# EasyEDA Pro project ProPrj_esp8266(esp12S)_2024-11-05.epro

# Schematic Schematic1_1
Create Date: 2024-01-08; Page Name: P1; Project Name: esp8266(esp12S); Schematic Name: Schematic1_1; Update Date: 2024-03-04; Company: YUAXI; Drawed: YUAXI; Page Size: A4; Reviewed: YUAXI; Version: V1.0
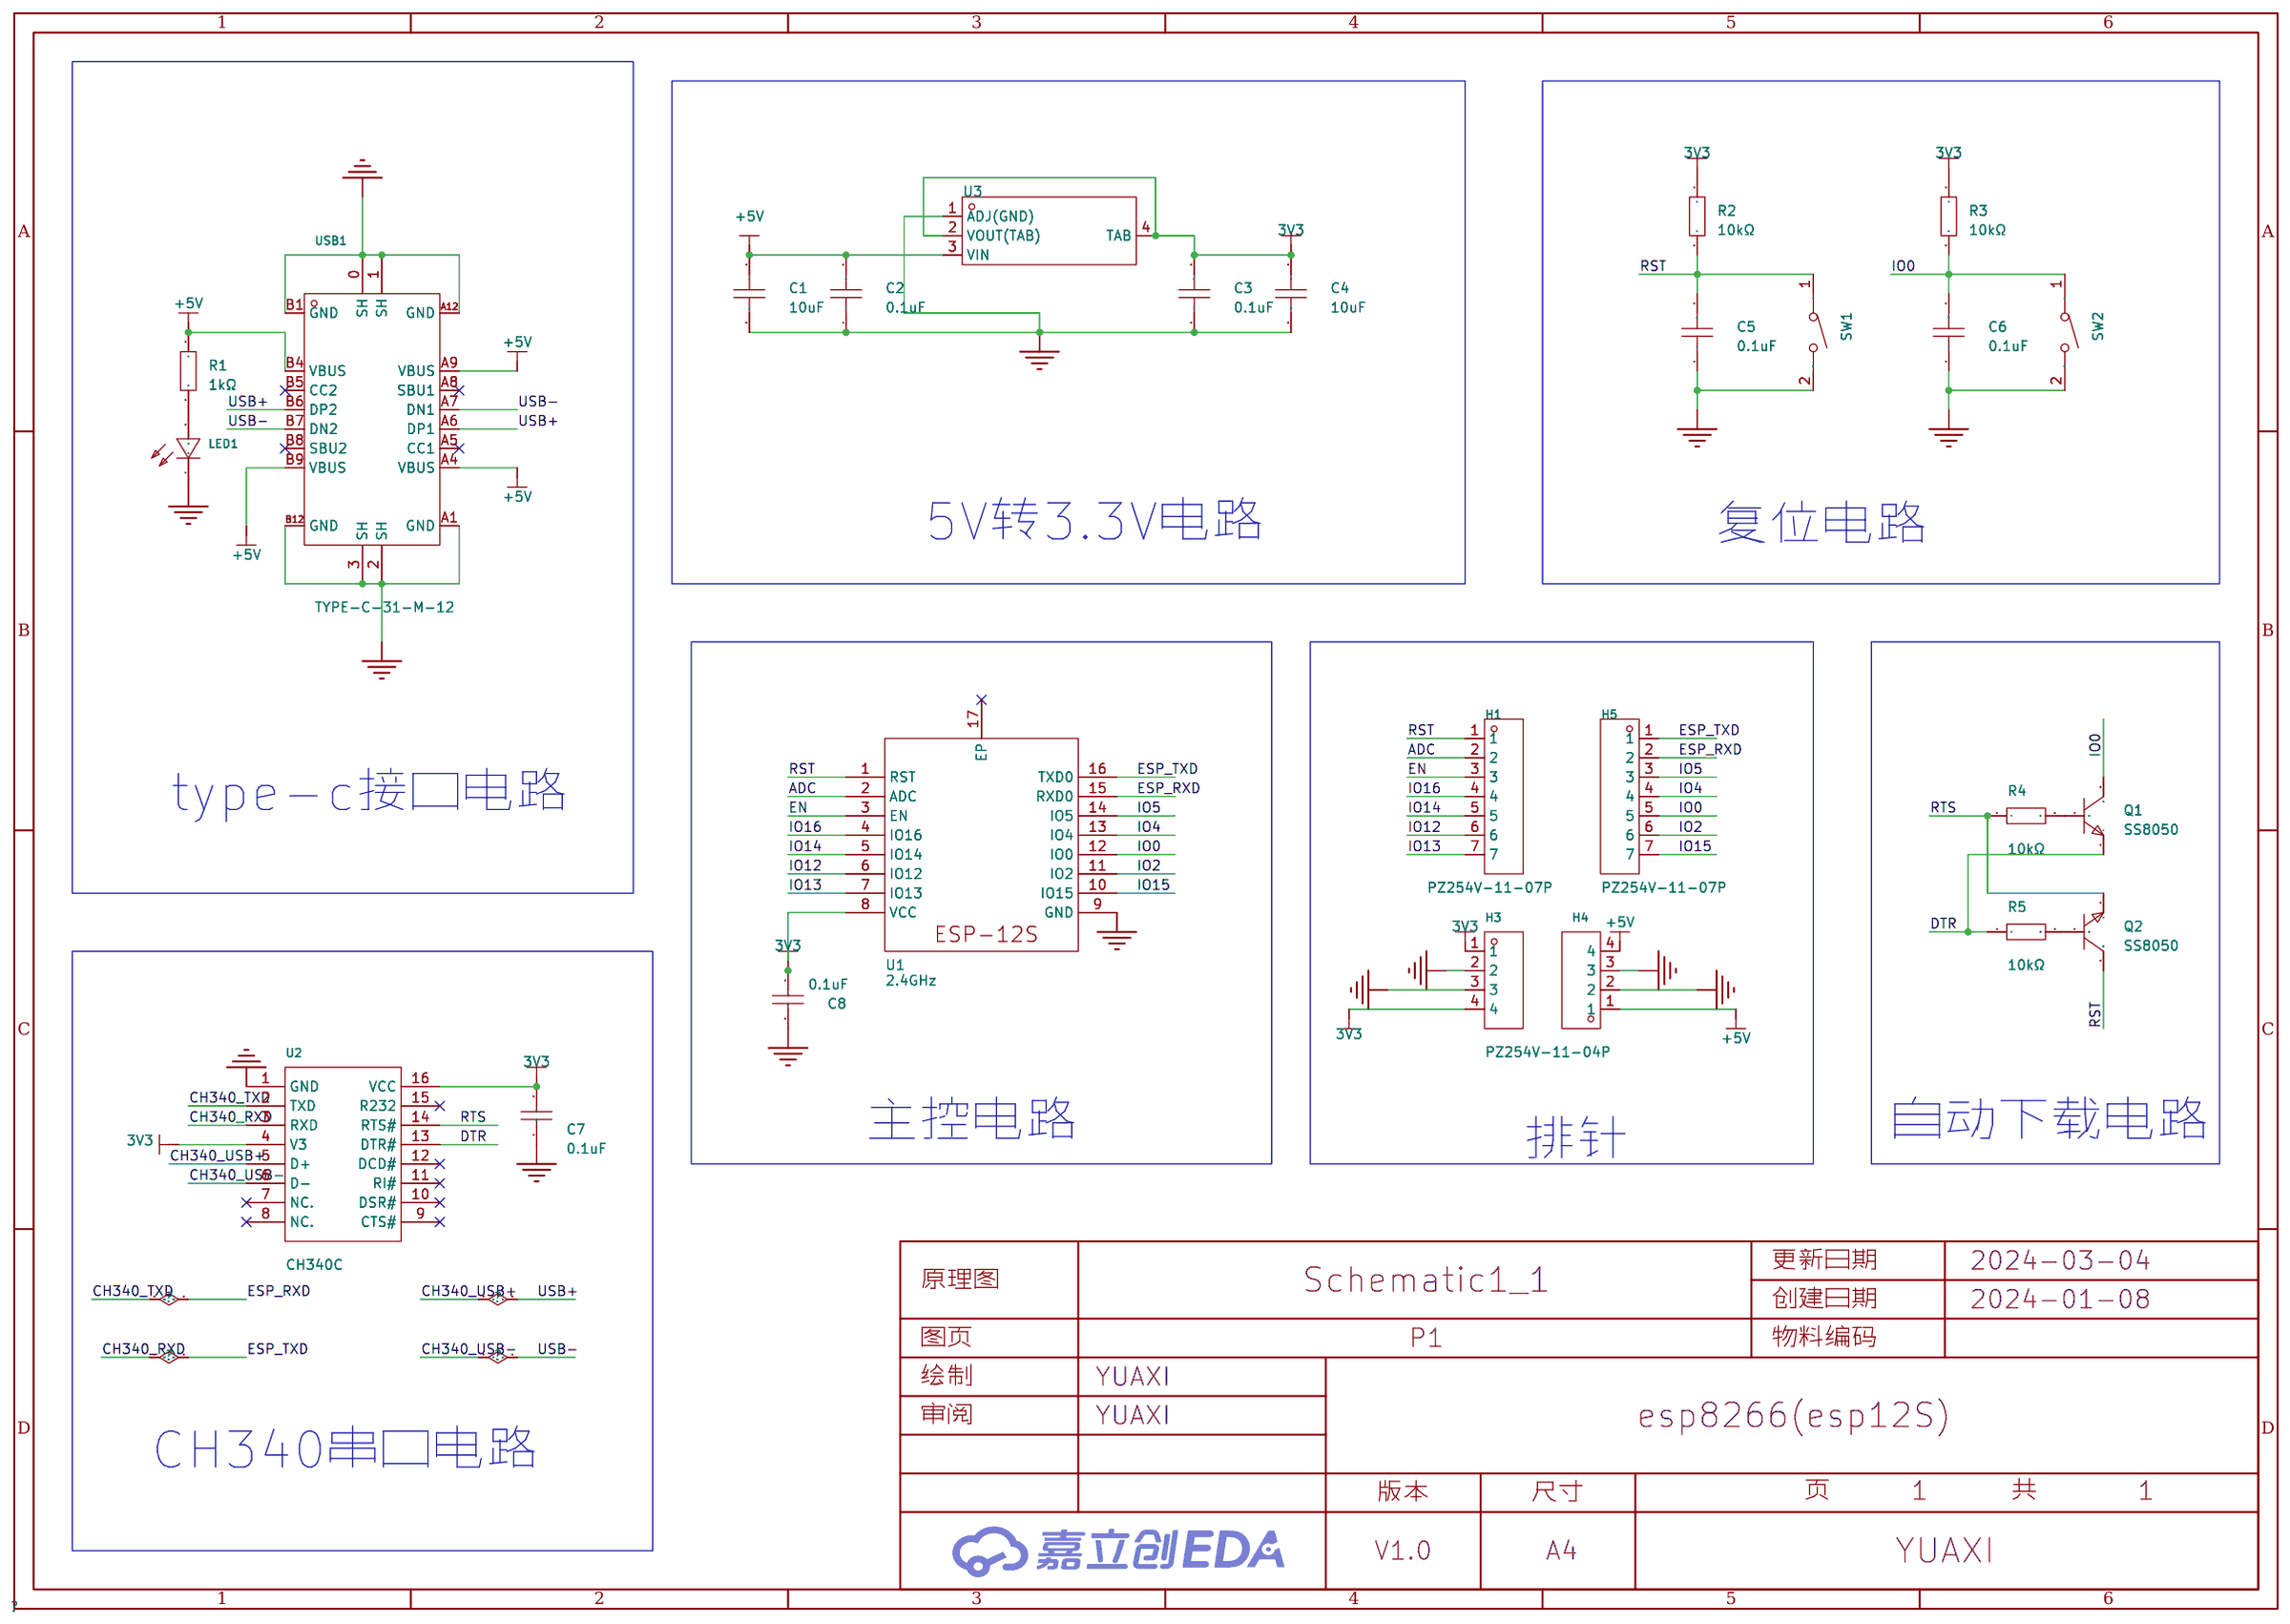
[diagram p0: schematic sheet]

## Parts
C1  10uF  [C0603]
C2  0.1uF  [C0603]
C3  0.1uF  [C0603]
C4  10uF  [C0603]
C5  0.1uF  [C0603]
C6  0.1uF  [C0603]
C7  0.1uF  [C0603]
C8  0.1uF  [C0603]
H1  PZ254V-11-07P  [HDR-TH_7P-P2.54-V-M]
H3  PZ254V-11-04P  [HDR-TH_4P-P2.54-V-M]
H4  PZ254V-11-04P  [HDR-TH_4P-P2.54-V-M]
H5  PZ254V-11-07P  [HDR-TH_7P-P2.54-V-M]
LED1  NCD0603R1  [LED0603-RD_RED]
Q1  SS8050  [SOT-23-3_L2.9-W1.3-P1.90-LS2.4-BR]
Q2  SS8050  [SOT-23-3_L2.9-W1.3-P1.90-LS2.4-BR]
R1  1kΩ  [R0603]
R2  10kΩ  [R0603]
R3  10kΩ  [R0603]
R4  10kΩ  [R0603]
R5  10kΩ  [R0603]
SW1  TS-1088-AR02016  [SW-SMD_L3.9-W3.0-P4.45]
SW2  TS-1088-AR02016  [SW-SMD_L3.9-W3.0-P4.45]
U1  2.4GHz  [WIRELM-SMD_ESP-12S]
U2  CH340C  [SOP-16_L10.0-W3.9-P1.27-LS6.0-BL]
U3  AMS1117-3.3  [SOT-223-4_L6.5-W3.5-P2.30-LS7.0-BR]
USB1  TYPE-C-31-M-12  [USB-C_SMD-TYPE-C-31-M-12]

## Library data of the parts
C1 C3 C5 C6 = CC0603KRX7R9BB104: 容值:100nF;精度:±10%;额定电压:50V;材质(温度系数):X7R;; LCSC Part Name: 100nF ±10% 50V; Supplier Part: C14663; Manufacturer: YAGEO(国巨); Supplier Footprint: 0603; JLCPCB Part Class: 基础库; Datasheet: https://atta.szlcsc.com/upload/public/pdf/source/20180910/C282072_33301C7F631E79921B82A8DAC6BCC5B3.pdf; Supplier: LCSC; Tolerance: ±10%; Voltage Rated: 50V; Temperature Coefficient: X7R
C2 C4 = CL10A106KP8NNNC: 容值:10uF;精度:±10%;额定电压:10V;材质(温度系数):X5R;; LCSC Part Name: 10uF ±10% 10V; Supplier Part: C19702; Manufacturer: SAMSUNG(三星); Supplier Footprint: 0603; JLCPCB Part Class: 基础库; Datasheet: https://atta.szlcsc.com/upload/public/pdf/source/20160103/1457707703378.pdf; Supplier: LCSC; Tolerance: ±10%; Voltage Rated: 10V; Temperature Coefficient: X5R
C7 C8 = 0603F104M500NT: 容值:100nF;精度:±20%;额定电压:50V;材质(温度系数):Y5V;; LCSC Part Name: 100nF ±20% 50V; Supplier Part: C42998; Manufacturer: FH(风华); Supplier Footprint: 0603; JLCPCB Part Class: 扩展库; Datasheet: https://atta.szlcsc.com/upload/public/pdf/source/20170923/C42998_1506149457343988769.pdf; Supplier: LCSC; Tolerance: ±20%; Voltage Rated: 50V; Temperature Coefficient: Y5V
H1 H5 = PZ254V-11-07P: 排数:单排;总PIN位数:7P;间距:2.54mm;插针结构:1x7P;行距:-;安装类型:直插;圆针/方针:方针;额定电流:-;额定电压:-;配合针长度:6mm;塑高:2.5mm;端接针长度:3mm;触头材质:黄铜;触头镀层:-;工作温度范围:-40℃~+105℃;颜色:黑色;; LCSC Part Name: 2.54mm 1x7P 直插 方针; Supplier Part: C492406; Manufacturer: XFCN(兴飞); Supplier Footprint: 插件,P=2.54mm; JLCPCB Part Class: 扩展库; Datasheet: https://atta.szlcsc.com/upload/public/pdf/source/20200309/C492406_654C533EE691117E22DD9F76C114C2D9.pdf; Supplier: LCSC; Number of Rows: 单排; Number of Pins: 7P; Pitch: 2.54mm; Pin Structure: 1x7P; Mounting Type: 直插; Circluar Pins/Square Pins: 方针; Length of Mating Pin: 6mm; Insulation Height: 2.5mm; Length of End Connection Pin: 3mm; Contact Material: 黄铜; Operating Temperature Range: -40℃~+105℃; Color: 黑色
H3 H4 = PZ254V-11-04P: 排数:单排;总PIN位数:4P;间距:2.54mm;插针结构:1x4P;行距:-;安装类型:直插;圆针/方针:方针;额定电流:3A;额定电压:250V;配合针长度:6mm;塑高:2.5mm;端接针长度:3mm;触头材质:-;工作温度范围:-40℃~+105℃;颜色:黑色;; LCSC Part Name: 2.54mm 1x4P 直插 方针; Supplier Part: C2691448; Manufacturer: XFCN(兴飞); Supplier Footprint: 插件,P=2.54mm; JLCPCB Part Class: Extended Part; Datasheet: https://atta.szlcsc.com/upload/public/pdf/source/20200309/C492403_F9F19131791D08044AD4F84F8E751A34.pdf; Supplier: LCSC; Number of Rows: 单排; Number of Pins: 4P; Pitch: 2.54mm; Pin Structure: 1x4P; Mounting Type: 直插; Circluar Pins/Square Pins: 方针; Current Rating (Max): 3A; Voltage Rating (Max): 250V; Length of Mating Pin: 6mm; Insulation Height: 2.5mm; Length of End Connection Pin: 3mm; Operating Temperature Range: -40℃~+105℃; Color: 黑色
LED1 = NCD0603R1_C84263: 发光颜色:红灯;; LCSC Part Name: 红灯 0603红灯   正贴; Supplier Part: C84263; Manufacturer: 国星光电; Supplier Footprint: 0603; JLCPCB Part Class: 扩展库; Datasheet: https://atta.szlcsc.com/upload/public/pdf/source/20200820/C84263_DABC6A75E58F576973B407FDBA283D60.pdf; Supplier: LCSC; Emitted Color: 红灯
Q1 Q2 = SS8050_C2150: 晶体管类型:NPN;集射极击穿电压(Vceo):25V;集电极电流(Ic):1.5A;功率(Pd):300mW;直流电流增益(hFE@Ic,Vce):200@100mA,1V;; LCSC Part Name: NPN 25V 1.5A Y1 200-350; Supplier Part: C2150; Manufacturer: CJ(江苏长电/长晶); Supplier Footprint: SOT-23; JLCPCB Part Class: 基础库; Datasheet: https://atta.szlcsc.com/upload/public/pdf/source/20230322/AEE86F4B043774EFF80CAEA14A37D9E9.pdf; Supplier: LCSC; Transistor Type: NPN; Collector-Emitter Breakdown Voltage (Vceo): 25V; Collector Current (Ic): 1.5A; Power Dissipation (Pd): 300mW; Collector Cut-Off Current (Icbo): 100nA; Collector-Emitter Saturation Voltage (VCE(sat)@Ic,Ib): 500mV@800mA,80mA; DC Current Gain (hFE@Ic,Vce): 200@100mA,1V; Transition Frequency (fT): 100MHz; Operating Temperature: +150℃@(Tj)
R1 = 0603WAF1001T5E: 电阻类型:厚膜电阻;阻值:1kΩ;精度:±1%;功率:100mW;温度系数:±100ppm/℃;; LCSC Part Name: 厚膜电阻 1kΩ ±1% 100mW; Supplier Part: C21190; Manufacturer: UNI-ROYAL(厚声); Supplier Footprint: 0603; JLCPCB Part Class: 基础库; Datasheet: https://atta.szlcsc.com/upload/public/pdf/source/20200306/C422600_1E6D84923E4A46A82E41ADD87F860B5C.pdf; Supplier: LCSC; Type: 厚膜电阻; Tolerance: ±1%; Power(Watts): 100mW; Temperature Coefficient: ±100ppm/℃; Overload Voltage (Max): 75V; Operating Temperature Range: -55℃~+155℃
R2-R5 = 0603WAF1002T5E: 电阻类型:厚膜电阻;阻值:10kΩ;精度:±1%;功率:100mW;; LCSC Part Name: 厚膜电阻 10kΩ ±1% 100mW; Supplier Part: C25804; Manufacturer: UNI-ROYAL(厚声); Supplier Footprint: 0603; JLCPCB Part Class: 基础库; Datasheet: https://atta.szlcsc.com/upload/public/pdf/source/20200306/C422600_1E6D84923E4A46A82E41ADD87F860B5C.pdf; Supplier: LCSC; Type: 厚膜电阻; Tolerance: ±1%; Power(Watts): 100mW; Temperature Coefficient: ±100ppm/℃; Overload Voltage (Max): 75V; Operating Temperature Range: -55℃~+155℃
SW1 SW2 = TS-1088-AR02016: 电路结构:单刀单掷;带支架:否;触点电流:50mA;额定电压(DC):12V;安装方式:立贴;绝缘电阻:100MΩ;作用力:160gf@±50gf;机械寿命:10万次;; LCSC Part Name: 4*3*2mm 立贴 轻触开关; Supplier Part: C720477; Manufacturer: XUNPU(讯普); Supplier Footprint: SMD; JLCPCB Part Class: 扩展库; Datasheet: https://atta.szlcsc.com/upload/public/pdf/source/20200810/C720475_60D09DD6C54279ADDB2DC25100F1CC11.pdf; Supplier: LCSC; Circuit: 单刀单掷; Actuator Style: 圆形按钮; Switch Length: 4mm; Switch Width: 3mm; Switch Height: 2mm; Strike Gundam: 否; Contact Current: 50mA; Voltage Rating (DC): 12V; Mounting Style: 立贴; Insulation Resistance: 100MΩ; Actuator/Cap Color: 黑色; Operating Force: 160gf@±50gf; Pin Style: SMD接片; Mechanical Life: 10万次; Operating Temperature: -30℃~+80℃
U1 = ESP-12S: 频率:2.4GHz;发射功率:16dBm;核心处理器:ESP32;天线形式:PCB 板载天线;接收灵敏度:-90dBm;; Supplier Part: C82898; Manufacturer: Ai-Thinker(安信可); Supplier Footprint: SMD,16x24mm; JLCPCB Part Class: 扩展库; Datasheet: https://atta.szlcsc.com/upload/public/pdf/source/20180726/C82898_9FA1708C134FC93491C81360A8B073B0.pdf; Supplier: LCSC; Output Power: 16dBm; Core Processor: ESP32; Support Interface: GPIO；UART；PWM；ADC; Antenna Type: PCB 板载天线; Wireless Standard: 802.11b/g/n; Operating Voltage: 3.3V; Receive  Current: 56mA; Send  Current: 170mA; Sensitivity: -90dBm; Operating Temperature: -20℃~+85℃
U2 = CH340C: 应用功能:收发器;接口协议:USB 2.0;数据速率:2Mbps;; LCSC Part Name: CH340C USB转串口芯片 CH340; Supplier Part: C84681; Manufacturer: WCH(南京沁恒); Supplier Footprint: SOP-16; JLCPCB Part Class: 扩展库; Datasheet: https://atta.szlcsc.com/upload/public/pdf/source/20200819/C84681_ADBED554CE321879DBD6B1D06488689C.pdf; Supplier: LCSC; Applications Function: 收发器; Protocol: USB 2.0; Data Rate: 2Mbps; Supply Voltage: 3.3V；5V
U3 = AMS1117-3.3_C347222: 输出类型:固定;最大输入电压:18V;输出电压:3.3V;输出电流:1A;电源纹波抑制比(PSRR):60dB@(120Hz);输出极性:正;; LCSC Part Name: 输入18V 输出3.3V 1A; Supplier Part: C347222; Manufacturer: UMW(友台半导体); Supplier Footprint: SOT-223; JLCPCB Part Class: Extended Part; Datasheet: https://atta.szlcsc.com/upload/public/pdf/source/20231109/155D79A26D9DB04352555A58D5969DC8.pdf; Supplier: LCSC; Output Type: 固定; Output Polarity: 正; Number of Outputs: 1; Maximum Input Voltage: 18V; Output Voltage: 3.3V; Dropout Voltage: 1.3V@(1A); Output Current: 1A; Power Supply Rejection Ratio (PSRR): 60dB@(120Hz)
USB1 = TYPE-C-31-M-12: 连接器类型:Type-C;标准:-;公母:母座;触点数量:16P;端口数量:1;安装方式:-;额定电流 - 电源:5A;触头材质:-;触头镀层:-;工作温度范围:-;焊接温度(最大值):-;; LCSC Part Name: Type-C 母座; Supplier Part: C165948; Manufacturer: 韩国韩荣; Supplier Footprint: SMD; JLCPCB Part Class: Extended Part; Datasheet: https://atta.szlcsc.com/upload/public/pdf/source/20220525/466408E853115E789EDB0DDC29077C05.pdf; Supplier: LCSC; Connector Type: Type-C; Gender: 母座; Number of Contacts: 16P; Number of Ports: 1; Current Rating - Power (Max): 5A

## Nets
3V3: C3.2 C4.2 C7.2 C8.1 H3.1 H3.4 R2.1 R3.1 U1.8(VCC) U2.4(V3) U2.16(VCC) U3.2(VOUT(TAB)) U3.4(TAB)
+5V: C1.2 C2.2 H4.1 H4.4 R1.2 U3.3(VIN) USB1.A4(VBUS) USB1.A9(VBUS) USB1.B4(VBUS) USB1.B9(VBUS)
GND: C1.1 C2.1 C3.1 C4.1 C5.1 C6.1 C7.1 C8.2 H3.2 H3.3 H4.2 H4.3 LED1.1(K) SW1.2 SW2.2 U1.9(GND) U2.1(GND) U3.1(ADJ(GND)) USB1.0(SH) USB1.1(SH) USB1.2(SH) USB1.3(SH) USB1.A1(GND) USB1.A12(GND) USB1.B1(GND) USB1.B12(GND)
ADC: H1.2 U1.2(ADC)
CH340_RXD: H5.1 U1.16(TXD0) U2.3(RXD)
CH340_TXD: H5.2 U1.15(RXD0) U2.2(TXD)
CH340_USB+: U2.5(D+) USB1.A6(DP1) USB1.B6(DP2)
CH340_USB-: U2.6(D-) USB1.A7(DN1) USB1.B7(DN2)
DTR: Q1.2(E) R5.1 U2.13(DTR#)
EN: H1.3 U1.3(EN)
IO0: C6.2 H5.5 Q1.3(C) R3.2 SW2.1 U1.12(IO0)
IO2: H5.6 U1.11(IO2)
IO4: H5.4 U1.13(IO4)
IO5: H5.3 U1.14(IO5)
IO12: H1.6 U1.6(IO12)
IO13: H1.7 U1.7(IO13)
IO14: H1.5 U1.5(IO14)
IO15: H5.7 U1.10(IO15)
IO16: H1.4 U1.4(IO16)
RST: C5.2 H1.1 Q2.3(C) R2.2 SW1.1 U1.1(RST)
RTS: Q2.2(E) R4.1 U2.14(RTS#)
$1N1116: LED1.2(A) R1.1
$1N4878: Q1.1(B) R4.2
$1N4917: Q2.1(B) R5.2

Not connected (* = marked no-connect by the designer): U1 17(EP)*; U2 7(NC.)* 8(NC.)* 9(CTS#)* 10(DSR#)* 11(RI#)* 12(DCD#)* 15(R232)*; USB1 A5(CC1)* A8(SBU1)* B5(CC2)* B8(SBU2)*

## Notes on the sheet
- 复位电路
- 5V转3.3V电路
- type-c接口电路
- 主控电路
- 排针
- 自动下载电路
- CH340串口电路

# Board PCB1_1
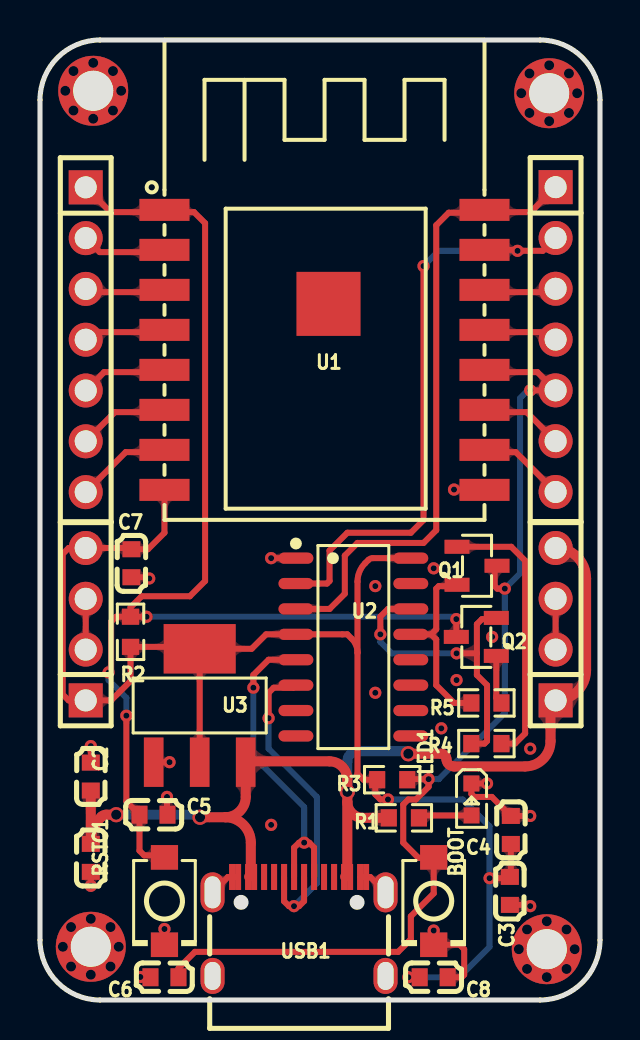
[diagram p1: board, top side]
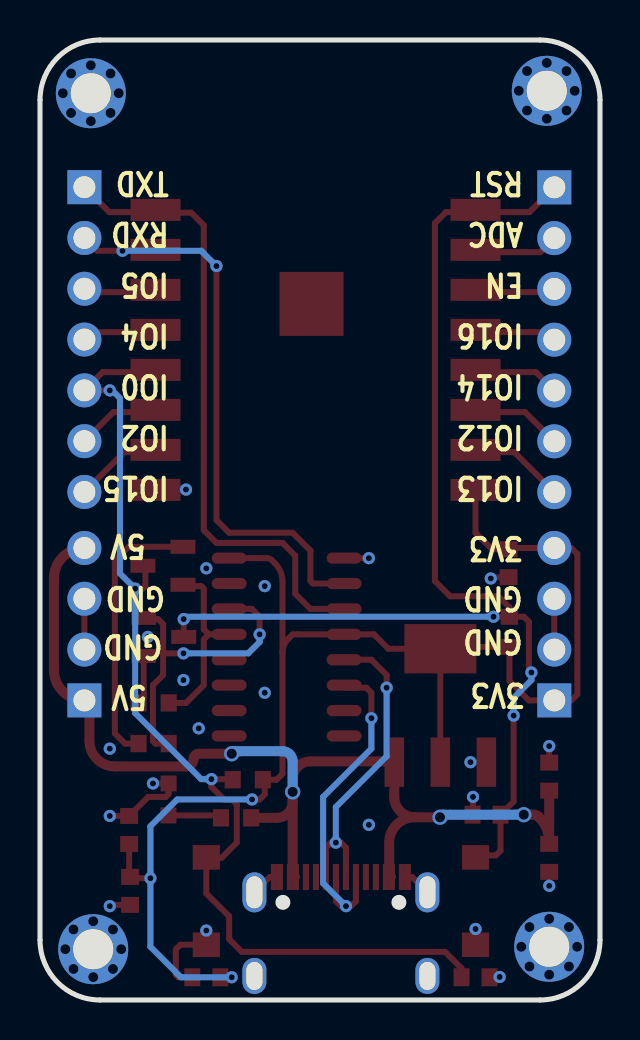
[diagram p2: board, bottom side, seen from below]

Outline 28 x 48 mm; copper layers: Top Layer, Bottom Layer. Coordinates in mm from the lower left corner of the outline.
Outline path: 0,45 0,3 arc(0.88,0.88) 3,0 25,0 arc(27.12,0.88) 28,3 28,45 arc(27.12,47.12) 25,48 3,48 arc(0.88,47.12) 0,45
Stack: Top Layer 0.035mm / Dielectric1 1.51mm FR4 er 4.5 / Bottom Layer 0.035mm

## Design rules (mm)
template: JLCPCB Capability(Two Layers Board)
spacing copperThickness1oz (default): track to track 0.102, other pairs 0.152 to 0.3
spacing copperThickness2oz: track to track 0.203, other pairs 0.152 to 0.3
track width copperThickness1oz (default): min 0.127, default 0.254, max 2.54
track width copperThickness2oz: min 0.203, default 0.254, max 2.54
differential pair differentialPair (default): width min 0.127, default 0.254, max 2.54; gap min 0.152, default 0.152
via viaSize (default): diameter min 0.5, default 0.61, max 10; hole min 0.3, default 0.305, max 6.3

## Placement (name value [footprint] x y rotation side)
BOOT  TS-1088-AR02016  [SW-SMD_L3.9-W3.0-P4.45]  19.69 4.95 270 top
C1  10uF  [C0603]  2.54 7.11 90 top
C2  0.1uF  [C0603]  2.54 11.17 270 top
C3  0.1uF  [C0603]  23.5 5.46 90 top
C4  10uF  [C0603]  23.54 8.5 270 top
C5  0.1uF  [C0603]  5.68 9.27 180 top
C6  0.1uF  [C0603]  6.22 1.14 0 top
C7  0.1uF  [C0603]  4.57 21.84 90 top
C8  0.1uF  [C0603]  19.69 1.14 0 top
LED1  NCD0603R1  [LED0603-RD_RED]  21.57 10.03 270 top
NOREF  -  [Pad_e13549]  2.54 2.66 0 top
NOREF#2  -  [Pad_e13617]  25.34 2.54 90 top
NOREF#3  -  [Pad_e13676]  25.46 45.34 180 top
NOREF#4  -  [HDR-TH_4P-P2.54-V-M]  2.29 18.79 90 top
NOREF#5  -  [HDR-TH_4P-P2.54-V-M]  25.78 18.79 90 top
NOREF#6  -  [HDR-TH_7P-P2.54-V-M]  2.29 33.01 270 top
NOREF#7  -  [HDR-TH_7P-P2.54-V-M]  25.78 33.02 270 top
NOREF#8  -  [Pad_e13685]  2.66 45.46 270 top
Q1  SS8050  [SOT-23-3_L2.9-W1.3-P1.90-LS2.4-BR]  21.85 21.71 180 top
Q2  SS8050  [SOT-23-3_L2.9-W1.3-P1.90-LS2.4-BR]  21.82 18.16 0 top
R1  1kΩ  [R0603]  18.19 9.11 180 top
R2  10kΩ  [R0603]  4.53 18.41 90 top
R3  10kΩ  [R0603]  17.61 11.01 0 top
R4  10kΩ  [R0603]  22.32 12.82 0 top
R5  10kΩ  [R0603]  22.32 14.85 0 top
RST  TS-1088-AR02016  [SW-SMD_L3.9-W3.0-P4.45]  6.22 4.95 270 top
U1  2.4GHz  [WIRELM-SMD_ESP-12S]  14.22 32.51 0 top
U2  CH340C  [SOP-16_L10.0-W3.9-P1.27-LS6.0-BL]  15.67 17.65 270 top
U3  AMS1117-3.3  [SOT-223-4_L6.5-W3.5-P2.30-LS7.0-BR]  7.98 14.73 270 top
USB1  TYPE-C-31-M-12  [USB-C_SMD-TYPE-C-31-M-12]  12.95 3.68 0 top

## Footprints (pads in the part's own frame, mm; a bottom-side part is the same pattern mirrored in y, then rotated)
C0603
  rect 0.8x0.9 smd: 1(-0.7,0) 2(0.7,0)
HDR-TH_4P-P2.54-V-M
  rect 1.7x1.7 hole 1.1: 1(-3.81,0)
  round 1.7 hole 1.1: 2(-1.27,0) 3(1.27,0) 4(3.81,0)
HDR-TH_7P-P2.54-V-M
  rect 1.7x1.7 hole 1.1: 1(-7.62,0)
  round 1.7 hole 1.1: 2(-5.08,0) 3(-2.54,0) 4(0,0) 5(2.54,0) 6(5.08,0) 7(7.62,0)
LED0603-RD_RED
  rect 0.8x0.8 smd: 1(-0.799,-0.004) 2(0.799,0.004)
Pad_e13549
  round 3.5 hole 2: 18(0,0)
Pad_e13617
  round 3.5 hole 2: 18(0,0)
Pad_e13676
  round 3.5 hole 2: 18(0,0)
Pad_e13685
  round 3.5 hole 2: 18(0,0)
R0603
  rect 0.806x0.864 smd: 1(-0.753,0) 2(0.753,0)
SOP-16_L10.0-W3.9-P1.27-LS6.0-BL
  oval 0.56x1.745 smd: 1(-4.445,-2.873) 2(-3.175,-2.873) 3(-1.905,-2.873) 4(-0.635,-2.873) 5(0.635,-2.873) 6(1.905,-2.873) 7(3.175,-2.873) 8(4.445,-2.873) 9(4.445,2.873) 10(3.175,2.873) 11(1.905,2.873) 12(0.635,2.873) 13(-0.635,2.873) 14(-1.905,2.873) 15(-3.175,2.873) 16(-4.445,2.873)
SOT-23-3_L2.9-W1.3-P1.90-LS2.4-BR
  rect 1.25x0.7 smd: 1(1,-0.95) 2(1,0.95) 3(-1,0)
SOT-223-4_L6.5-W3.5-P2.30-LS7.0-BR
  rect 2.47x0.98 smd: 1(2.835,-2.3) 2(2.835,0) 3(2.835,2.3)
  rect 2.47x3.6 smd: 4(-2.835,0)
SW-SMD_L3.9-W3.0-P4.45
  rect 1.23x1.36 smd: 1(-2.185,0) 2(2.185,0)
USB-C_SMD-TYPE-C-31-M-12
  oval 1.2x2 hole 0.8x1.6: 0(-4.325,1.706) 1(4.325,1.706)
  oval 1.2x1.8 hole 0.8x1.4: 2(4.325,-2.474) 3(-4.325,-2.474)
  rect 0.3x1.3 smd: A1(-3.35,2.474) A4(-2.55,2.474) A5(-1.25,2.474) A6(-0.25,2.474) A7(0.25,2.474) A8(1.25,2.474) A9(2.55,2.474) A12(3.35,2.474) B1(3.05,2.474) B4(2.25,2.474) B5(1.75,2.474) B6(0.75,2.474) B7(-0.75,2.474) B8(-1.75,2.474) B9(-2.25,2.474) B12(-3.05,2.474)
WIRELM-SMD_ESP-12S
  rect 2.5x1.1 smd: 1(-8.002,7) 2(-8.002,5) 3(-8,3) 4(-8.002,1) 5(-8.002,-1) 6(-8.002,-3) 7(-8.002,-5) 8(-8.001,-7) 9(8.001,-7) 10(8,-5) 11(8.001,-3) 12(8,-1) 13(8.001,1) 14(8.002,3) 15(8.001,5) 16(8,7)
  rect 3.2x3.2 smd: 17(0.2,2.3)

## Nets
3V3: C3.2 C4.2 C7.2 C8.1 NOREF#4.1 NOREF#4.4 R2.1 R3.1 U1.8 U2.4 U2.16 U3.2 U3.4
+5V: C1.2 C2.2 NOREF#5.1 NOREF#5.4 R1.2 U3.3 USB1.A4 USB1.A9 USB1.B4 USB1.B9
GND: BOOT.2 C1.1 C2.1 C3.1 C4.1 C5.1 C6.1 C7.1 C8.2 LED1.1 NOREF.18 NOREF#2.18 NOREF#3.18 NOREF#4.2 NOREF#4.3 NOREF#5.2 NOREF#5.3 NOREF#8.18 RST.2 U1.9 U2.1 U3.1 USB1.0 USB1.1 USB1.2 USB1.3 USB1.A1 USB1.A12 USB1.B1 USB1.B12
ADC: NOREF#6.2 U1.2
CH340_RXD: NOREF#7.1 U1.16 U2.3
CH340_TXD: NOREF#7.2 U1.15 U2.2
CH340_USB+: U2.5 USB1.A6 USB1.B6
CH340_USB-: U2.6 USB1.A7 USB1.B7
DTR: Q1.2 R5.1 U2.13
EN: NOREF#6.3 U1.3
IO0: BOOT.1 C6.2 NOREF#7.5 Q1.3 R3.2 U1.12
IO2: NOREF#7.6 U1.11
IO4: NOREF#7.4 U1.13
IO5: NOREF#7.3 U1.14
IO12: NOREF#6.6 U1.6
IO13: NOREF#6.7 U1.7
IO14: NOREF#6.5 U1.5
IO15: NOREF#7.7 U1.10
IO16: NOREF#6.4 U1.4
RST: C5.2 NOREF#6.1 Q2.3 R2.2 RST.1 U1.1
RTS: Q2.2 R4.1 U2.14
$1N1116: LED1.2 R1.1
$1N4878: Q1.1 R4.2
$1N4917: Q2.1 R5.2

Pads without a net: U1 17; U2 7 8 9 10 11 12 15; USB1 A5 A8 B5 B8

## Via types
v1: diameter 0.61, hole 0.305, Top Layer to Bottom Layer, 39 vias
v2: diameter 0.6, hole 0.5, Top Layer to Bottom Layer, 32 vias
v3: diameter 0.762, hole 0.508, Top Layer to Bottom Layer, 4 vias

## Routing (per net, layer and track width the routed paths; a pad name or vN(x,y) marks a point on that pad's centre or on a via; arc(x,y) is an arc through that point)
3V3: length 73.6
  Top Layer w0.299: U2.16 16.64,22.09 arc(16.52,22.07) 16.42,22 16.26,21.84 arc(15.97,21.42) 15.88,20.92 15.88,17.36 ; U3.2 7.98,17.56 ; NOREF#4.4 4.42,22.6 arc(4.5,22.58) C7.2 5.4,22.54 6.22,23.36 U1.8 ; 15.88,17.36 15.88,11.31 16.17,11.01 R3.1 16.76,10.92 16.76,10.28 17.02,10.03 v1(17.4,10.03) ; 15.88,17.36 arc(15.8,17.74) 15.58,18.06 15.37,18.28 15.11,18.28 ; 18.99,1.26 18.86,1.14 v1(18.42,1.14)
  Top Layer w0.3: C4.2 23.54,6.2 23.43,6.09 v1(22.48,6.09) ; NOREF#4.4 1.43,22.6 1.13,22.3 1.13,15.28 1.43,14.98 NOREF#4.1 3.56,14.98 4.53,15.95 R2.1 7.89,17.66 7.98,17.56 10.58,17.56 11.3,18.28 U2.4 15.11,18.28
  Bottom Layer w0.299: v1(18.42,1.14) 20.96,1.14 22.48,2.66 v1(22.48,6.09) 22.48,8.69 21.14,10.03 v1(17.4,10.03)
+5V: length 54.9
  Top Layer w0.5: 10.54,11.93 14.48,11.93 arc(15.11,11.67) 15.37,11.04 v3(15.37,10.41) 15.37,9.9 ; 15.37,9.9 15.37,6.31 arc(15.34,6.22) 15.26,6.16 ; 15.37,9.9 arc(15.6,9.34) 16.16,9.11 R1.2 ; C1.2 2.54,7.91 ; 2.54,7.91 C2.2 ; 2.54,7.91 arc(2.67,8.58) 3.05,9.14 3.09,9.18 arc(3.18,9.24) 3.3,9.27 v3(3.81,9.27) ; v3(18.42,12.31) 20.07,12.31 arc(20.25,12.24) 20.32,12.06 arc(20.43,11.79) 20.7,11.68 24.26,11.68 arc(25.16,12.05) 25.53,12.95 25.53,14.73 arc(25.6,14.91) NOREF#5.1 arc(26.86,15.43) 27.31,16.5 27.31,21.08 arc(26.86,22.15) NOREF#5.4 ; v3(8,9.14) 9.27,9.14 ; 9.27,9.14 arc(9.99,9.44) 10.29,10.15 10.29,11.89 arc(10.29,11.89) U3.3 ; 9.27,9.14 arc(10.17,8.77) 10.54,7.87 10.54,6.29 arc(10.54,6.26) 10.53,6.23 arc(10.5,6.19) 10.46,6.16
  Bottom Layer w0.5: v3(3.81,9.27) 7.87,9.27 v3(8,9.14) ; v3(15.37,10.41) 15.37,11.93 arc(15.52,12.29) 15.88,12.44 18.29,12.44 arc(18.38,12.4) v3(18.42,12.31)
GND: length 25.7
  Top Layer w0.299: C5.1 6.35,9.29 v1(6.35,10.15) ; C1.1 v1(2.54,5.71) ; USB1.1 16.51,6.15 USB1.A12 USB1.B1 ; LED1.1 v1(22.35,10.83) ; v1(2.54,12.69) 2.54,12.33 ; v1(6.22,3.55) RST.2 ; 20.39,1.14 21.08,1.14 21.21,1.26 21.21,2.53 20.98,2.76 BOOT.2 v1(19.69,3.47) ; USB1.B12 USB1.A1 9.4,6.15 USB1.0 ; v1(11.56,22.09) U2.1 ; U3.1 v1(6.48,11.89) ; U1.9 22.21,25.52 v1(20.7,25.52) ; C7.1 5.4,21.14 v1(5.46,21.08)
  Top Layer w0.3: v1(24.51,9.2) C4.1 22.59,10.15 21.72,10.15 21.57,10.3 LED1.1 ; v1(24.51,4.69) 24.45,4.75 23.5,4.75 ; NOREF#4.2 NOREF#4.3 ; NOREF#5.2 NOREF#5.3
  vias: v1(5.02,1.15) v1(11.56,8.76) v1(16.76,20.7) v1(16.76,15.36) v1(19.69,21.58) v1(20.07,13.58) v1(20.83,16) v1(22.61,18.16) v1(24.51,12.57) v2(1.14,2.66) v2(1.26,45.46) v2(1.55,3.65) v2(1.55,1.67) v2(1.67,46.45) v2(1.67,44.47) v2(2.54,4.06) v2(2.54,1.26) v2(2.66,46.86) v2(2.66,44.06) v2(3.53,3.65) v2(3.53,1.67) v2(3.65,46.45) v2(3.65,44.47) v2(3.94,2.66) v2(4.06,45.46) v2(23.94,2.54) v2(24.06,45.34) v2(24.35,3.53) v2(24.35,1.55) v2(24.47,46.33) v2(24.47,44.35) v2(25.34,3.94) v2(25.34,1.14) v2(25.46,46.74) v2(25.46,43.94) v2(26.33,3.53) v2(26.33,1.55) v2(26.45,46.33) v2(26.45,44.35) v2(26.74,2.54) v2(26.86,45.34)
ADC: length 4.2
  Top Layer w0.3: 6.22,37.39 2.99,37.39 NOREF#6.2
CH340_RXD: length 31.8
  Top Layer w0.3: NOREF#7.1 24.53,39.39 22.22,39.39 22.19,39.36 20.44,39.36 19.81,38.74 19.81,23.49 19.18,22.85 15.88,22.85 15.24,22.22 15.24,20.31 14.48,19.55 U2.3
CH340_TXD: length 30.1
  Top Layer w0.3: v1(19.18,36.7) 19.18,24 18.54,23.36 15.37,23.36 14.48,22.47 14.48,20.95 14.35,20.82 U2.2 ; NOREF#7.2 25.14,37.46 v1(23.88,37.46) 23.83,37.51 U1.15
  Bottom Layer w0.3: v1(19.18,36.7) 19.94,37.46 v1(23.88,37.46)
CH340_USB+: length 16
  Top Layer w0.3: v1(10.67,15.62) 10.67,16.25 11.43,17.01 U2.5 ; USB1.A6 12.7,7.62 12.95,7.87 v1(13.21,7.87) 13.46,7.87 13.7,7.63 USB1.B6
  Bottom Layer w0.3: v1(13.21,7.87) 13.21,9.65 10.67,12.19 v1(10.67,15.62)
CH340_USB-: length 17.3
  Top Layer w0.299: U2.6 12.67,15.62 11.68,15.62 11.43,15.36 v1(11.43,14.09)
  Top Layer w0.3: USB1.B7 12.2,4.94 12.45,4.69 v1(12.7,4.69) 12.95,4.69 13.2,4.94 USB1.A7
  Bottom Layer w0.3: v1(12.7,4.69) 13.84,5.84 13.84,10.15 11.43,12.57 v1(11.43,14.09)
DTR: length 9.3
  Top Layer w0.3: 20.85,20.76 20.78,20.7 19.94,20.7 19.81,20.57 19.81,18.54 19.56,18.28 ; 19.56,18.28 19.81,18.03 19.81,15.74 20.7,14.85 R5.1 ; 19.56,18.28 U2.13
EN: length 4
  Top Layer w0.3: 6.22,35.39 2.45,35.39 NOREF#6.3
IO0: length 53
  Top Layer w0.299: C6.2 7.05,1.14
  Top Layer w0.3: 22.22,31.39 24.87,31.39 NOREF#7.5 v1(24.51,30.48) ; C6.2 6.92,1.58 7.75,2.41 17.91,2.41 18.54,3.04 18.54,4.19 19.69,5.33 BOOT.1 19.66,7.11 18.92,7.11 18.16,7.87 18.16,9.77 18.42,10.03 18.8,10.03 19.43,10.66 v1(19.43,11.04) 18.39,11.04 R3.2 ; Q1.3 22.73,21.59 22.73,20.7 22.86,20.57 v1(23.24,20.57)
  Bottom Layer w0.3: v1(19.43,11.04) 19.94,11.04 23.24,14.34 v1(23.24,20.57) 24,21.33 24,30.09 24.39,30.48 v1(24.51,30.48)
IO2: length 4.2
  Top Layer w0.3: 22.22,29.39 24.33,29.39 NOREF#7.6
IO4: length 3.7
  Top Layer w0.3: 22.22,33.39 25.41,33.39 NOREF#7.4
IO5: length 3.6
  Top Layer w0.3: NOREF#7.3 25.61,35.39 22.23,35.39
IO12: length 4.5
  Top Layer w0.3: NOREF#6.6 3.75,29.39 6.22,29.39
IO13: length 4.8
  Top Layer w0.3: 6.22,27.39 4.29,27.39 NOREF#6.7
IO14: length 4.3
  Top Layer w0.3: NOREF#6.5 3.21,31.39 6.22,31.39
IO15: length 4.4
  Top Layer w0.3: NOREF#7.7 23.79,27.39 22.22,27.39
IO16: length 4.1
  Top Layer w0.3: 6.22,33.39 2.67,33.39 NOREF#6.4
RST: length 61.2
  Top Layer w0.299: RST.1 6.12,7.23 5.21,7.23 4.98,7.46 C5.2
  Top Layer w0.3: v1(4.32,14.22) 4.32,9.92 C5.2 ; NOREF#6.1 3.53,39.39 7.7,39.39 8.25,38.84 8.25,20.95 7.49,20.19 5.08,20.19 4.53,19.63 R2.2 ; 5.33,19.17 v1(5.33,19.16) R2.2 ; R2.2 3.8,19.16 3.56,18.92 3.56,16.5 v1(3.43,16.38) ; Q2.3 v1(20.82,19.04)
  Bottom Layer w0.3: v1(5.33,19.16) 20.7,19.16 v1(20.82,19.04) ; v1(4.32,14.22) 4.32,15.11 3.43,16 v1(3.43,16.38)
RTS: length 16
  Top Layer w0.3: R4.1 22.22,12.82 22.35,12.95 22.35,15.74 21.84,16.25 21.84,17.33 ; 21.84,17.33 v1(20.83,17.33) ; 21.84,17.33 21.84,18.79 22.1,19.04 22.75,19.04 Q2.2 ; U2.14 17.4,19.55 17.02,19.17 v1(17.02,18.28)
  Bottom Layer w0.3: v1(20.83,17.33) 17.59,17.33 17.02,17.9 v1(17.02,18.28)
$1N1116: length 2.7
  Top Layer w0.3: R1.1 19.07,9.23 LED1.2
$1N4878: length 13.7
  Top Layer w0.3: Q1.1 23.56,22.66 24.26,21.97 24.26,13.33 23.75,12.82 R4.2
$1N4917: length 2.5
  Top Layer w0.3: Q2.1 22.82,15.11 R5.2

## Copper pours and planes (outline as drawn; the poured copper is in the pictures)
GND on Top Layer: -5.08,54.35 32,54.35 32,-6.99 -5.08,-6.99
GND on Bottom Layer: -9.52,60.32 35.69,60.32 35.69,-11.06 -9.52,-11.06

Small or netless copper shapes (teardrops, artwork), in the pictures only: 151 on Top Layer, 24 on Bottom Layer

## Text on the board
Bottom Silkscreen Layer: 3V3 | RST | ADC | EN | IO16 | IO14 | IO12 | IO13 | GND | TXD | RXD | IO5 | IO4 | IO0 | IO2 | IO15 | 5V
Top Solder Mask Layer: YUAXI
